# EAGLE design 8 ch CV buffer design block (EAGLE 9.6.2)
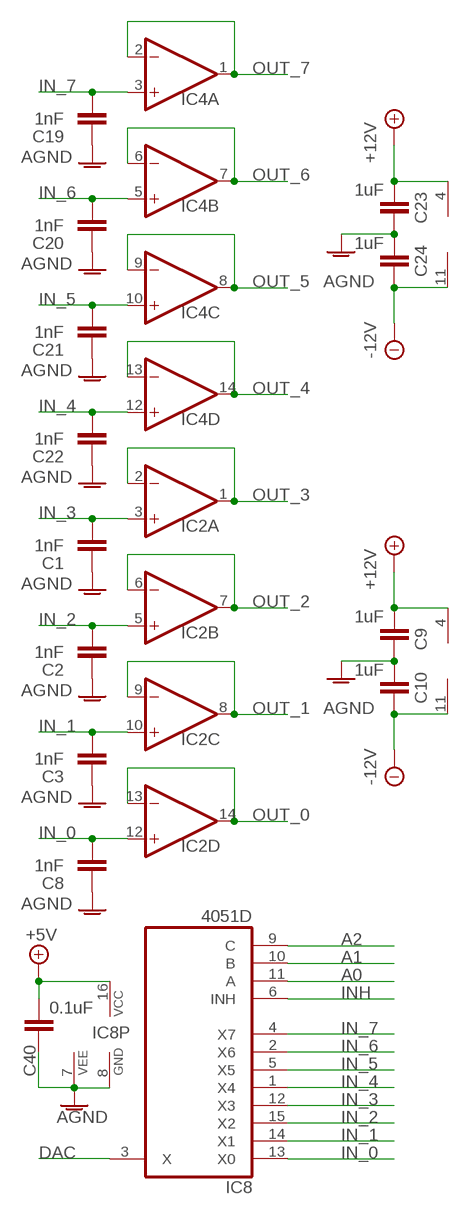
[diagram p0: schematic, sheet 1]

## Parts
C1  1nF  C-EU-J0603  [C0603-J]
C2  1nF  C-EU-J0603  [C0603-J]
C3  1nF  C-EU-J0603  [C0603-J]
C8  1nF  C-EU-J0603  [C0603-J]
C9  1uF  C-EU-J0402  [C0402-J]
C10  1uF  C-EU-J0402  [C0402-J]
C19  1nF  C-EU-J0603  [C0603-J]
C20  1nF  C-EU-J0603  [C0603-J]
C21  1nF  C-EU-J0603  [C0603-J]
C22  1nF  C-EU-J0603  [C0603-J]
C23  1uF  C-EU-J0402  [C0402-J]
C24  1uF  C-EU-J0402  [C0402-J]
C40  0.1uF  C-EU-J0402  [C0402-J]
IC2  TL074JT  [TSSOP14J]
IC4  TL074JT  [TSSOP14J]
IC8  4051D  [SO16]

## Nets
+5V: C40.2 IC8.16(VCC)
+12V: C9.1 C23.1 IC2.4(P:V+) IC4.4(P:V+)
-12V: C10.2 C24.2 IC2.11(P:V-) IC4.11(P:V-)
A0: IC8.11(A)
A1: IC8.10(B)
A2: IC8.9(C)
AGND: C1.1 C2.1 C3.1 C8.1 C9.2 C10.1 C19.1 C20.1 C21.1 C22.1 C23.2 C24.1 C40.1 IC8.7(VEE) IC8.8(GND)
DAC: IC8.3(X)
IN_0: C8.2 IC2.12(D:+IN) IC8.13(X0)
IN_1: C3.2 IC2.10(C:+IN) IC8.14(X1)
IN_2: C2.2 IC2.5(B:+IN) IC8.15(X2)
IN_3: C1.2 IC2.3(A:+IN) IC8.12(X3)
IN_4: C22.2 IC4.12(D:+IN) IC8.1(X4)
IN_5: C21.2 IC4.10(C:+IN) IC8.5(X5)
IN_6: C20.2 IC4.5(B:+IN) IC8.2(X6)
IN_7: C19.2 IC4.3(A:+IN) IC8.4(X7)
INH: IC8.6(INH)
OUT_0: IC2.13(D:-IN) IC2.14(D:OUT)
OUT_1: IC2.8(C:OUT) IC2.9(C:-IN)
OUT_2: IC2.6(B:-IN) IC2.7(B:OUT)
OUT_3: IC2.1(A:OUT) IC2.2(A:-IN)
OUT_4: IC4.13(D:-IN) IC4.14(D:OUT)
OUT_5: IC4.8(C:OUT) IC4.9(C:-IN)
OUT_6: IC4.6(B:-IN) IC4.7(B:OUT)
OUT_7: IC4.1(A:OUT) IC4.2(A:-IN)

## Library data of the parts
C1-C3 C8-C10 C19-C24 C40 = joakim:C-EU-J: CAPACITOR, European symbol
IC2 IC4 = joakim:TL074J: OP AMP
IC8 = 40xx:4051: 8-channel ANALOG MULTIPLEXER

## Board
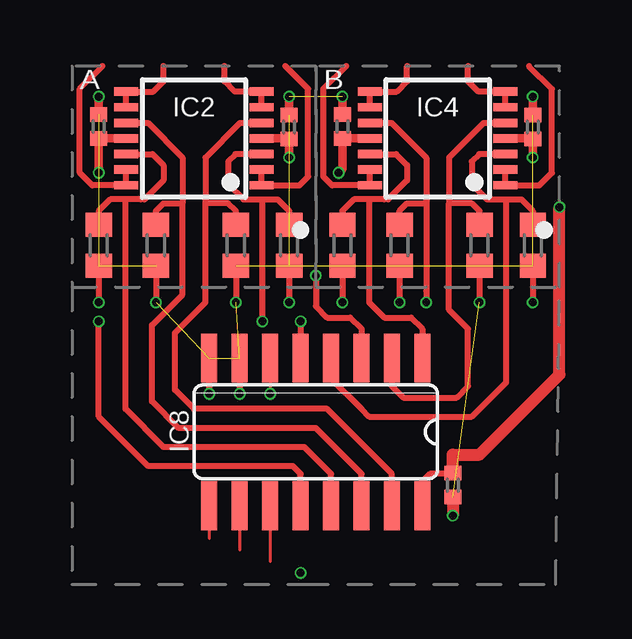
[diagram p1: board, top side]
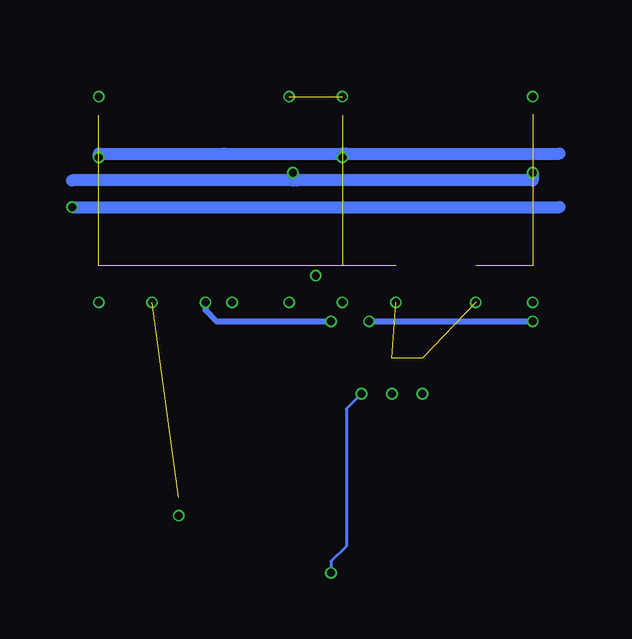
[diagram p2: board, bottom side, seen from below]

No outline drawn. Coordinates in mm, seen from the top.
Copper layers (1*16): Top 0.035mm / dielectric 1.6mm / Bottom 0.035mm
Design rules "jlcpcb-2layers": minimum track width 5mil, minimum drill 0.3mm, track to track 5mil, track to pad 5mil, pad to pad 5mil, via to via 5mil, smd to smd 5mil, copper to edge 0.2mm, drill to drill 6mil, minimum pad ring 10mil, minimum via ring 3mil, stop-mask expansion 4mil, vias tented up to drill 0mil, thermal gap 10mil

### Footprints (pad centres in the part's own frame; a part is rotated, then mirrored left to right if it is on the bottom)
C0603-J = smd 1 x 1.1: 1 -0.85,0; 2 0.85,0
C0402-J = smd 0.6 x 0.7: 1 -0.5,0; 2 0.5,0
TSSOP14J = smd 0.35 x 1: 1 -1.95,-2.825; 2 -1.3,-2.825; 3 -0.65,-2.825; 4 0,-2.825; 5 0.65,-2.825; 6 1.3,-2.825; 7 1.95,-2.825; 8 1.95,2.825; 9 1.3,2.825; 10 0.65,2.825; 11 0,2.825; 12 -0.65,2.825; 13 -1.3,2.825; 14 -1.95,2.825
SO16 = smd 0.66 x 2.032: 1 -4.445,-3.073; 2 -3.175,-3.073; 3 -1.905,-3.073; 4 -0.635,-3.073; 5 0.635,-3.073; 6 1.905,-3.073; 7 3.175,-3.073; 8 4.445,-3.073; 9 4.445,3.073; 10 3.175,3.073; 11 1.905,3.073; 12 0.635,3.073; 13 -0.635,3.073; 14 -1.905,3.073; 15 -3.175,3.073; 16 -4.445,3.073

### Placement (x,y rotation side)
C1  9.05,14.13 90 top
C2  6.83,14.13 90 top
C3  3.49,14.13 90 top
C8  1.11,14.13 90 top
C9  9.05,19.05 90 top
C10  1.11,19.07 270 top
C19  19.21,14.13 90 top
C20  16.99,14.13 90 top
C21  13.65,14.13 90 top
C22  11.27,14.13 90 top
C23  19.21,19.05 90 top
C24  11.27,19.07 270 top
C40  15.88,4.13 90 top
IC2  5.08,18.57 90 top
IC4  15.24,18.57 90 top
IC8  10.16,6.35 180 top

### Tracks (layer width: path | path; a pad name or v marks a point on that pad's centre or on a via)
+5V  (via drill 0.33)
  Top 0.254: C40.2 15.85,4.6 14.92,4.6 14.61,4.29 IC8.16
  Top 0.508: C40.2 15.88,5.4 16.99,5.4 20.32,8.73 v20.32,15.72
  Bottom 0.508: v20.32,15.72 0,15.72
+12V  (via drill 0.33)
  Top 0.356: IC2.4 9.03,18.57 C9.1 v9.05,17.78 | IC4.4 19.18,18.57 C23.1 v19.21,17.78
  Bottom 0.508: 9.05,17.94 8.89,17.94 0,17.94 | v19.21,17.78 19.21,17.94 13.97,17.94 9.05,17.94 | 9.05,17.94 v9.05,17.78
-12V  (via drill 0.33)
  Top 0.356: IC2.11 C10.2 v1.11,17.14 | IC4.11 C24.2 11.27,17.3 v11.11,17.14
  Bottom 0.508: v1.11,17.14 1.11,16.83 10.95,16.83 11.11,16.83 | v11.11,17.14 11.11,16.83 | 11.11,16.83 20.32,16.83
A0
  Top 0.127: IC8.11 8.26,0.95
A1
  Top 0.127: IC8.10 6.99,1.43
A2
  Top 0.127: IC8.9 5.71,1.91
AGND  (via drill 0.33)  (14 unrouted)
  Top 0.254: C8.1 v1.11,11.75 | C3.1 v3.49,11.75 | C2.1 v6.83,11.75 | C1.1 v9.05,11.75 | C22.1 v11.27,11.75 | C21.1 v13.65,11.75 | C20.1 v16.99,11.75 | C19.1 v19.21,11.75 | IC8.8 v5.71,7.94 | IC8.7 v6.99,7.94
  Top 0.356: v1.11,20.32 C10.1 | v9.05,20.32 C9.2 | v11.27,20.32 C24.1 | v19.21,20.32 C23.2
  Top 0.508: C40.1 v15.88,2.86
DAC  (via drill 0.33)
  Top 0.254: v10.16,12.86 10.16,11.59 10.64,11.11 11.59,11.11 12.06,10.64 IC8.3
IN_0
  Top 0.254: IC2.12 3.35,17.92 3.81,17.46 3.81,16.83 3.02,16.03 2.86,16.03 2.22,16.03 | C8.2 1.11,15.56 1.59,16.03 2.22,16.03 | IC8.13 10.79,4.6 9.68,5.71 3.81,5.71 2.22,7.3 2.22,16.03
IN_1
  Top 0.254: IC2.10 3.16,19.22 4.6,17.78 4.6,15.88 | 4.6,15.88 4.6,12.06 3.33,10.79 3.33,7.62 4.45,6.51 10.16,6.51 12.06,4.6 IC8.14 | C3.2 3.49,15.56 3.81,15.88 4.6,15.88
IN_2
  Top 0.254: 5.56,16.03 5.56,17.78 7,19.22 IC2.5 | 5.56,16.03 5.56,15.93 | 5.56,16.03 5.56,15.88 | 5.56,15.88 5.56,11.75 4.29,10.48 4.29,8.1 5.08,7.3 10.64,7.3 13.34,4.6 IC8.15 | C2.2 6.83,15.56 6.51,15.88 5.56,15.88
IN_3  (via drill 0.33)
  Top 0.254: C1.2 9.05,15.56 8.57,16.03 7.94,16.03 | IC2.3 6.81,17.92 6.51,17.62 6.51,16.67 7.14,16.03 7.94,16.03 | v7.94,10.95 7.94,16.03 | IC8.12 9.53,4.6 9.21,4.92 3.17,4.92 1.11,6.99 v1.11,10.95
  Bottom 0.254: v7.94,10.95 v1.11,10.95
IN_4
  Top 0.254: IC4.12 13.51,17.92 13.97,17.46 13.97,16.83 13.18,16.03 13.02,16.03 12.38,16.03 | C22.2 11.27,15.56 11.75,16.03 12.38,16.03 | 12.38,16.03 12.38,11.75 13.02,11.11 14.13,11.11 14.61,10.64 IC8.1
IN_5  (via drill 0.33)
  Top 0.254: IC4.10 13.32,19.22 14.76,17.78 14.76,15.88 | C21.2 13.65,15.56 13.97,15.88 14.76,15.88 | v9.53,10.95 IC8.5 | 14.76,15.88 14.76,12.22 v14.76,11.75
  Bottom 0.254: v14.76,11.75 14.76,11.43 14.29,10.95 v9.53,10.95
IN_6
  Top 0.254: 15.72,16.03 15.72,17.78 17.16,19.22 IC4.5 | 15.72,16.03 15.72,15.93 | 15.72,16.03 15.72,15.88 | 15.72,15.88 15.72,11.43 16.51,10.64 16.51,8.26 16.03,7.78 13.81,7.78 13.34,8.26 IC8.2 | C20.2 16.99,15.56 16.67,15.88 15.72,15.88
IN_7
  Top 0.254: C19.2 19.21,15.56 18.73,16.03 18.1,16.03 | IC4.3 16.97,17.92 16.67,17.62 16.67,16.67 17.3,16.03 18.1,16.03 | IC8.4 10.79,8.57 12.06,7.3 12.38,6.99 16.67,6.99 18.1,8.41 18.1,16.03
INH  (via drill 0.33)
  Top 0.127: IC8.6 v8.26,7.94
  Bottom 0.127: v8.26,7.94 8.89,7.3 8.89,1.59 9.53,0.95 v9.53,0.48
OUT_0
  Top 0.254: IC2.14 IC2.13 | IC2.14 IC2.13 2.3,17.3 | IC2.14 0.84,16.62 0.32,17.14 0.32,20.64 1.27,21.59
OUT_1
  Top 0.254: IC2.9 IC2.8 3.38,20.52 3.81,20.95 3.81,21.59
OUT_2
  Top 0.254: IC2.6 IC2.7 6.78,20.52 6.35,20.95 6.35,21.59
OUT_3
  Top 0.254: IC2.1 IC2.2 | IC2.1 IC2.2 7.86,17.3 | IC2.1 9.48,16.62 9.84,16.99 9.84,20.64 8.89,21.59
OUT_4
  Top 0.254: IC4.14 IC4.13 | IC4.14 IC4.13 12.46,17.3 | IC4.14 10.84,16.62 10.48,16.99 10.48,20.64 11.43,21.59
OUT_5
  Top 0.254: IC4.9 IC4.8 13.54,20.52 13.97,20.95 13.97,21.59
OUT_6
  Top 0.254: IC4.6 IC4.7 16.94,20.52 16.51,20.95 16.51,21.59
OUT_7
  Top 0.254: IC4.1 IC4.2 | IC4.1 IC4.2 18.02,17.3 | IC4.1 19.48,16.62 20,17.14 20,20.64 19.05,21.59

### Text on the board
tNames: A | B